# EAGLE schematic reader-and-latch-client-schematic (EAGLE 6.5.0)
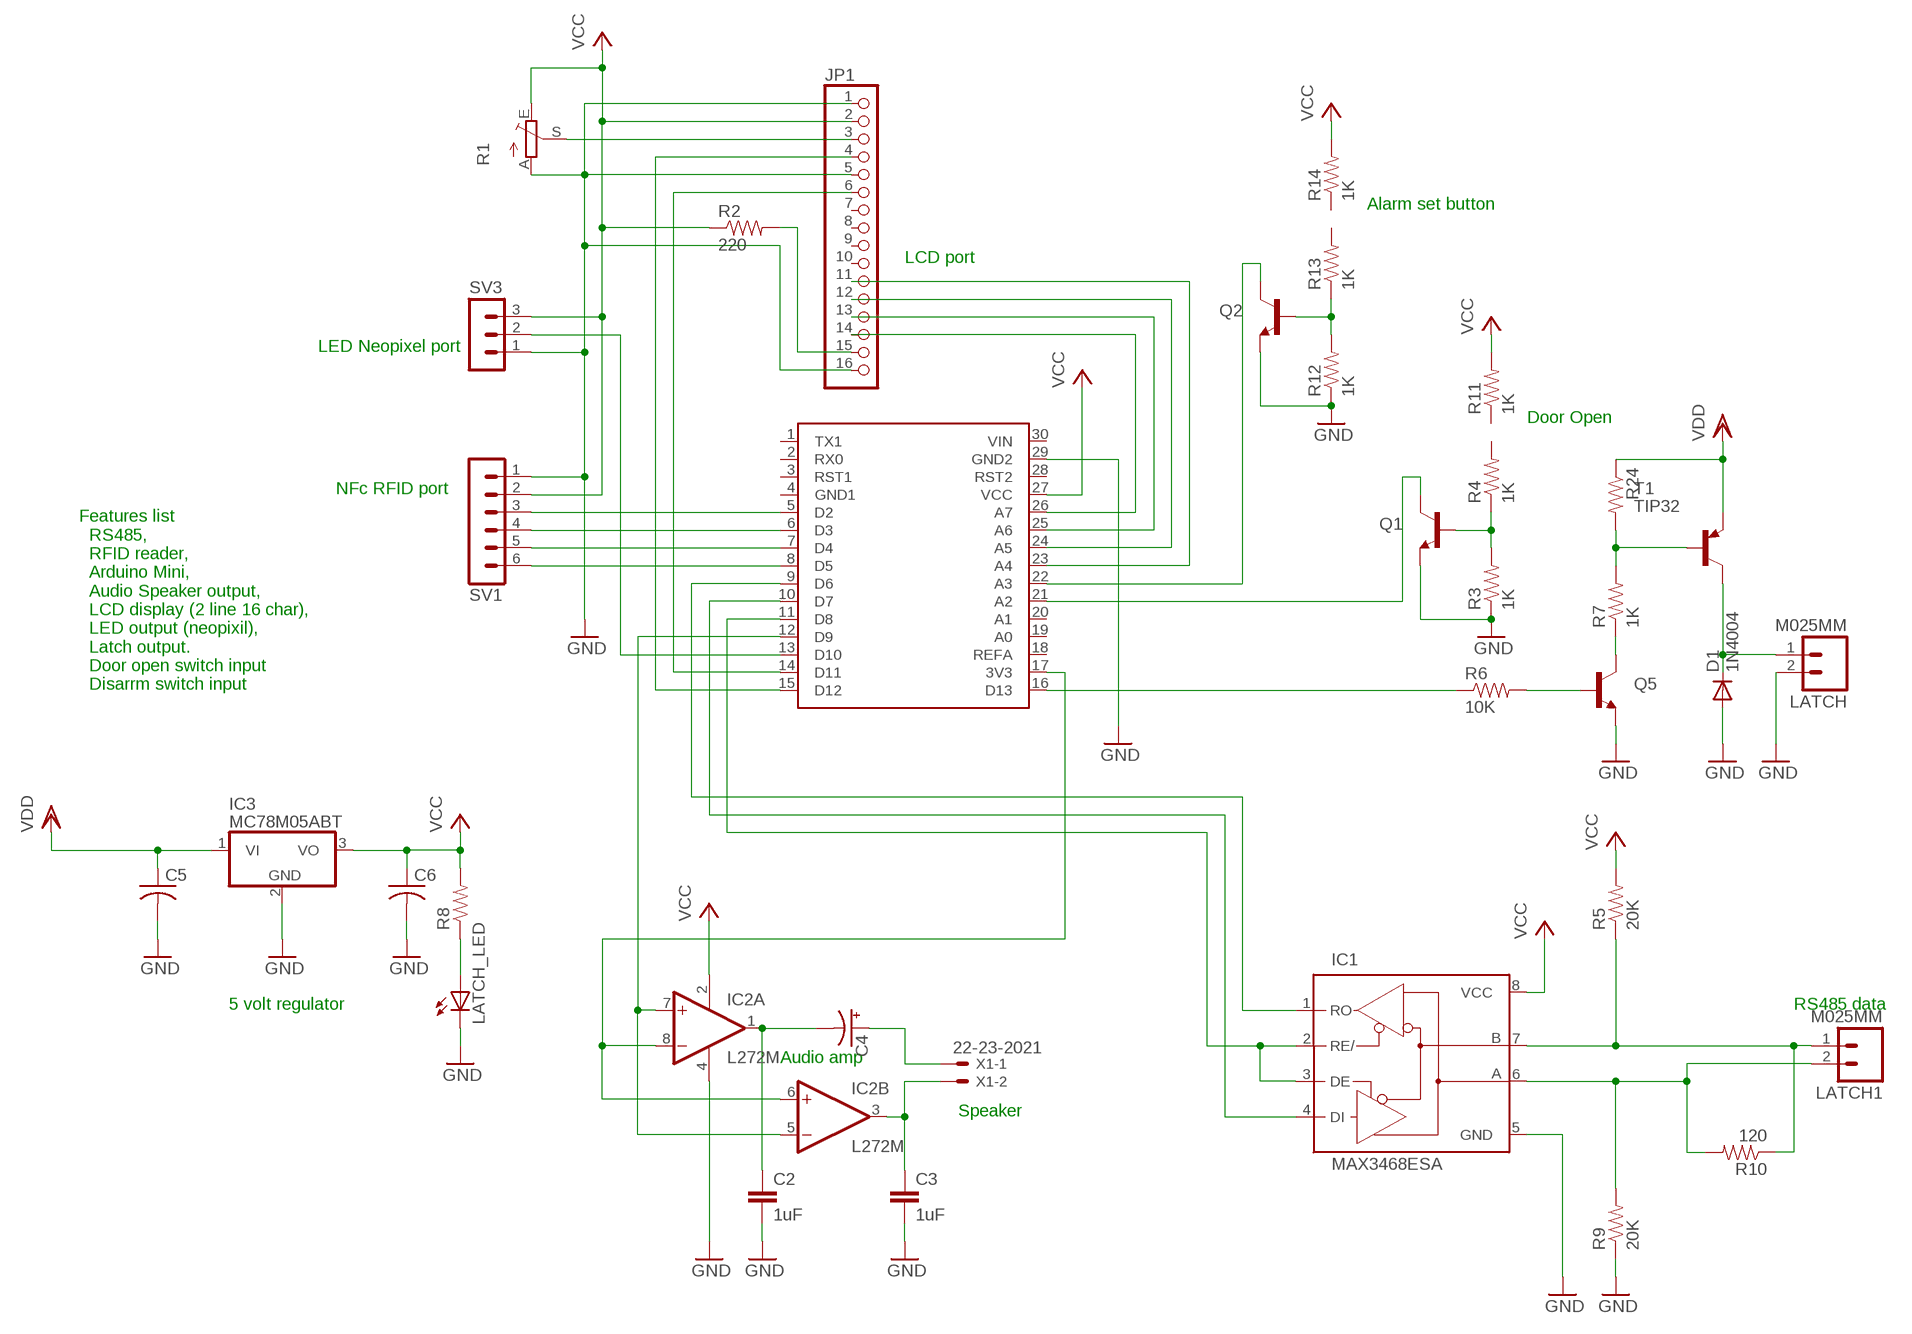
[diagram p0: schematic, sheet 1]

## Parts
C2  1uF  1UF-25V-10%(0805)  [0805]
C3  1uF  1UF-25V-10%(0805)  [0805]
C4  CAP_POLPTH1  [CPOL-RADIAL-100UF-25V]
C5  C-USC1206  [C1206]
C6  C-USC1206  [C1206]
D1  1N4004  [DO41-10]
IC1  MAX3468ESA  [SO08]
IC2  L272M  [DIL08]
IC3  MC78M05ABT  [TO220V]
JP1  PINHD-1X16  [1X16]
LATCH  M025MM  [SCREWTERMINAL-5MM-2]
LATCH1  M025MM  [SCREWTERMINAL-5MM-2]
LATCH_LED  LED3MM  [LED3MM]
Q1  TRANSISTOR_NPNTO-92-AMMO  [TO-92-AMMO]
Q2  TRANSISTOR_NPNTO-92-AMMO  [TO-92-AMMO]
Q5  TRANSISTOR_NPNTO-92-AMMO  [TO-92-AMMO]
R1  TRIM_EU-CT6  [CT6]
R2  220  10KOHM1/6W5%(PTH)KIT  [AXIAL-0.3-KIT]
R3  1K  10KOHM1/6W5%(PTH)KIT  [AXIAL-0.3-KIT]
R4  1K  10KOHM1/6W5%(PTH)KIT  [AXIAL-0.3-KIT]
R5  20K  10KOHM1/6W5%(PTH)KIT  [AXIAL-0.3-KIT]
R6  10K  10KOHM1/6W5%(PTH)KIT  [AXIAL-0.3-KIT]
R7  1K  10KOHM1/6W5%(PTH)KIT  [AXIAL-0.3-KIT]
R8  10KOHM1/6W5%(PTH)KIT  [AXIAL-0.3-KIT]
R9  20K  10KOHM1/6W5%(PTH)KIT  [AXIAL-0.3-KIT]
R10  120  10KOHM1/6W5%(PTH)KIT  [AXIAL-0.3-KIT]
R11  1K  10KOHM1/6W5%(PTH)KIT  [AXIAL-0.3-KIT]
R12  1K  10KOHM1/6W5%(PTH)KIT  [AXIAL-0.3-KIT]
R13  1K  10KOHM1/6W5%(PTH)KIT  [AXIAL-0.3-KIT]
R14  1K  10KOHM1/6W5%(PTH)KIT  [AXIAL-0.3-KIT]
R24  10KOHM1/6W5%(PTH)KIT  [AXIAL-0.3-KIT]
SV1  MA06-1  [MA06-1]
SV3  MA03-1  [MA03-1]
T1  TIP32  [TO220]
U$1  ARDUINO-NANO  [ARDUINO-NANO]
X1  22-23-2021  [22-23-2021]

## Nets
GND: C2.2 C3.2 C5.2 C6.2 D1.A IC1.5(GND) IC2.4(P:GND) IC3.2(GND) JP1.1 JP1.5 JP1.16 LATCH.2 LATCH_LED.K(C) Q1.1(E) Q2.1(E) Q5.1(E) R1.A R3.P$1 R9.P$1 R12.P$1 SV1.1 SV3.1 U$1.29(GND2)
N$1: JP1.3 R1.S
N$2: IC2.6(B:+IN) IC2.8(A:-IN) U$1.17(3V3)
N$3: IC1.6(A) LATCH1.2 R9.P$2 R10.P$2
N$4: IC1.7(B) LATCH1.1 R5.P$1 R10.P$1
N$5: IC2.5(B:-IN) IC2.7(A:+IN) U$1.12(D9)
N$6: IC1.1(RO) U$1.9(D6)
N$7: C2.1 C4.2(-) IC2.1(A:OUT)
N$8: C4.1(+) X1.1
N$9: C3.1 IC2.3(B:OUT) X1.2
N$10: Q5.2(B) R6.P$2
N$11: Q5.3(C) R7.P$1
N$12: R7.P$2 R24.P$2 T1.1(B)
N$13: IC1.4(DI) U$1.10(D7)
N$14: IC1.2(RE/) IC1.3(DE) U$1.11(D8)
N$15: LATCH_LED.A R8.P$1
N$16: R6.P$1 U$1.16(D13)
N$17: Q2.2(B) R12.P$2 R13.P$1
N$18: SV3.2 U$1.13(D10)
N$19: JP1.4 U$1.15(D12)
N$20: JP1.6 U$1.14(D11)
N$21: SV1.6 U$1.8(D5)
N$22: SV1.5 U$1.7(D4)
N$23: SV1.4 U$1.6(D3)
N$24: SV1.3 U$1.5(D2)
N$25: JP1.15 R2.P$2
N$26: JP1.14 U$1.26(A7)
N$27: JP1.13 U$1.25(A6)
N$28: JP1.12 U$1.24(A5)
N$29: D1.C LATCH.1 T1.2(C)
N$30: JP1.11 U$1.23(A4)
N$31: Q1.2(B) R3.P$2 R4.P$1
N$32: Q2.3(C) U$1.22(A3)
N$33: Q1.3(C) U$1.21(A2)
VCC: C6.1 IC1.8(VCC) IC2.2(P:V+) IC3.3(VO) JP1.2 R1.E R2.P$1 R5.P$2 R8.P$2 R11.P$2 R14.P$2 SV1.2 SV3.3 U$1.27(VCC)
VDD: C5.1 IC3.1(VI) R24.P$1 T1.3(E)
Unconnected: JP1.7 JP1.8 JP1.9 JP1.10 R4.P$2 R11.P$1 R13.P$2 R14.P$1 U$1.1(TX1) U$1.2(RX0) U$1.3(RST1) U$1.4(GND1) U$1.18(REFA) U$1.19(A0) U$1.20(A1) U$1.28(RST2) U$1.30(VIN)

## Notes on the sheet
- Alarm set button
- LCD port
- LED Neopixel port
- Door Open
- NFc RFID port
- Features list
      RS485, 
      RFID reader, 
      Arduino Mini, 
      Audio Speaker output, 
      LCD display (2 line 16 char), 
      LED output (neopixil), 
      Latch output.
      Door open switch input
      Disarrm switch input
- 5 volt regulator | RS485 data
- Audio amp
- Speaker

## Library data of the parts
C2 C3 = SparkFun-Capacitors:1UF-25V-10%(0805): CAP-08064; PROD_ID: CAP-08064
C4 = SparkFun-Capacitors:CAP_POL: Capacitor Polarized These are standard SMD and PTH capacitors. Normally 10uF, 47uF, and 100uF in electrolytic and tantalum varieties. Always verify the external diameter of the through hole cap, it varies with capacity, voltage, and manufacturer. The EIA devices should be standard.
C5 C6 = rcl:C-US: CAPACITOR, American symbol
D1 = diode:1N4004: DIODE general purpose rectifier, 1 A
IC1 = maxim:MAX34*: +5V, Fail-Safe, 40Mbps, Profibus RS-485/RS-422 Transceivers Source: MAX3465-MAX3469.pdf; MPN: MAX3468ESA+T; OC_FARNELL: unknown; OC_NEWARK: 76K6724
IC2 = linear:L272: OP AMP
IC3 = linear:MC78M: 500 mA Positive Voltage Regulators Source: Data sheet <http://www.onsemi.com/pub_link/Collateral/MC78M00-D.PDF>
JP1 = pinhead:PINHD-1X16: PIN HEADER
LATCH LATCH1 = SparkFun-Connectors:M02: Standard 2-pin 0.1" header. Use with - straight break away headers ( PRT-00116) - right angle break away headers (PRT-00553) - swiss pins (PRT-00743) - machine pins (PRT-00117) - female headers (PRT-00115) Molex polarized connector foot print use with: PRT-08233 with associated crimp pins and housings. 2.54_SCREWTERM for use with PRT-10571. 3.5mm Screw Terminal footprints for PRT-08084 5mm Screw Terminal footprints for use with PRT-08433
LATCH_LED = SparkFun-LED:LED: LEDs Standard schematic elements and footprints for 5mm, 3mm, 1206, and 0603 sized LEDs. 5mm - Spark Fun Electronics SKU : COM-00529 (and others)
Q1 Q2 Q5 = SparkFun-DiscreteSemi:TRANSISTOR_NPN: Generic NPN BJT MMBT2222A - TRANS-08049 (SOT-23, 1A 40V) MPSA42 - TRANS-09116 (SOT-23, 500mA 300V) MMBT5088LT1G - TRANS-11160 (SOT-23, 50 mA 30V)
R1 = pot:TRIM_EU-: POTENTIOMETER
R2-R14 R24 = SparkFun-Resistors:10KOHM1/6W5%(PTH): RES-08375; PROD_ID: RES-08375
SV1 = con-lstb:MA06-1: PIN HEADER; OC_FARNELL: unknown; OC_NEWARK: unknown
SV3 = con-lstb:MA03-1: PIN HEADER; OC_FARNELL: unknown; OC_NEWARK: unknown
T1 = transistor:TIP32: PNP Transistor Medium Power Linear Switching Applications Source: http://onsemi.com
U$1 = Arduino-stuff:ARDUINO-NANO
X1 = con-molex:22-23-2021: .100" (2.54mm) Center Header - 2 Pin; MF: MOLEX; MPN: 22-23-2021; OC_FARNELL: 1462926; OC_NEWARK: 25C3832